# Altium schematic sheet HF_Port.SchDoc
size A
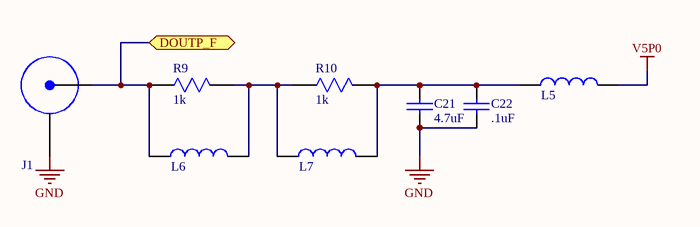
[diagram p0: HF_Port.SchDoc]

## Parts
C21  4.7uF  [SMD Capacitor 0603]
C22  .1uF  [SMD CAP 0402]
J1  Coax Connector  [SSMCX Throughhole Molex]  (value not drawn)
L5  Ferrite Bead  [BLM18KG601SN1D]  (value not drawn)
L6  Ferrite Bead  [CIG21L4R7MNE]  (value not drawn)
L7  Ferrite Bead  [CBC3225T101MR]  (value not drawn)
R9  1k  [SMD RES 0402]
R10  1k  [SMD RES 0402]

## Ports
DOUTP_F (bidir)

## Nets
GND: C21.1 C22.1 J1.1
V5P0: L5.2
DOUTP_F: J1.0 L6.1 R9.0 ; port DOUTP_F
NetC21_0: C21.0 C22.0 L5.1 L7.2 R10.1
NetL6_2: L6.2 L7.1 R9.1 R10.0

## Library data of the parts
C21 C22 = Capacitor: Value: C?
R9 R10 = Resistor: Value: ?